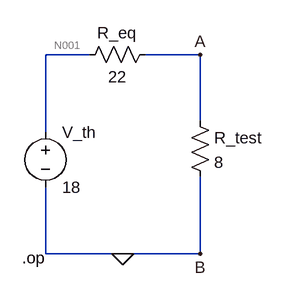
[diagram p0: schematic thevenin.asc]
thevenin.asc, the LTspice schematic file:
Version 4
SHEET 1 880 680
WIRE 96 32 32 32
WIRE 256 32 176 32
WIRE 256 128 256 32
WIRE 32 144 32 32
WIRE 32 320 32 224
WIRE 144 320 32 320
WIRE 256 320 256 208
WIRE 256 320 144 320
FLAG 144 320 0
FLAG 256 32 A
FLAG 256 320 B
SYMBOL voltage 32 128 R0
WINDOW 123 0 0 Left 0
WINDOW 39 0 0 Left 0
SYMATTR InstName V_th
SYMATTR Value 18
SYMBOL res 192 16 R90
WINDOW 0 0 56 VBottom 2
WINDOW 3 32 56 VTop 2
SYMATTR InstName R_eq
SYMATTR Value 22
SYMBOL res 240 112 R0
SYMATTR InstName R_test
SYMATTR Value 8
TEXT -2 326 Left 2 !.op

The netlist it stands for:
* thevenin.asc
V_th N001 0 18
R_eq A N001 22
R_test A 0 8
.op
.backanno
.end

* Results of the author's LTspice run, read from the files saved beside the schematic
* Operating Point:
*   V(n001) = 18 V
*   V(a) = 4.8 V
*   I(R_test) = 600 mA
*   I(R_eq) = -600 mA
*   I(V_th) = -600 mA